# EAGLE design mrShark Debugger (EAGLE 6.1)
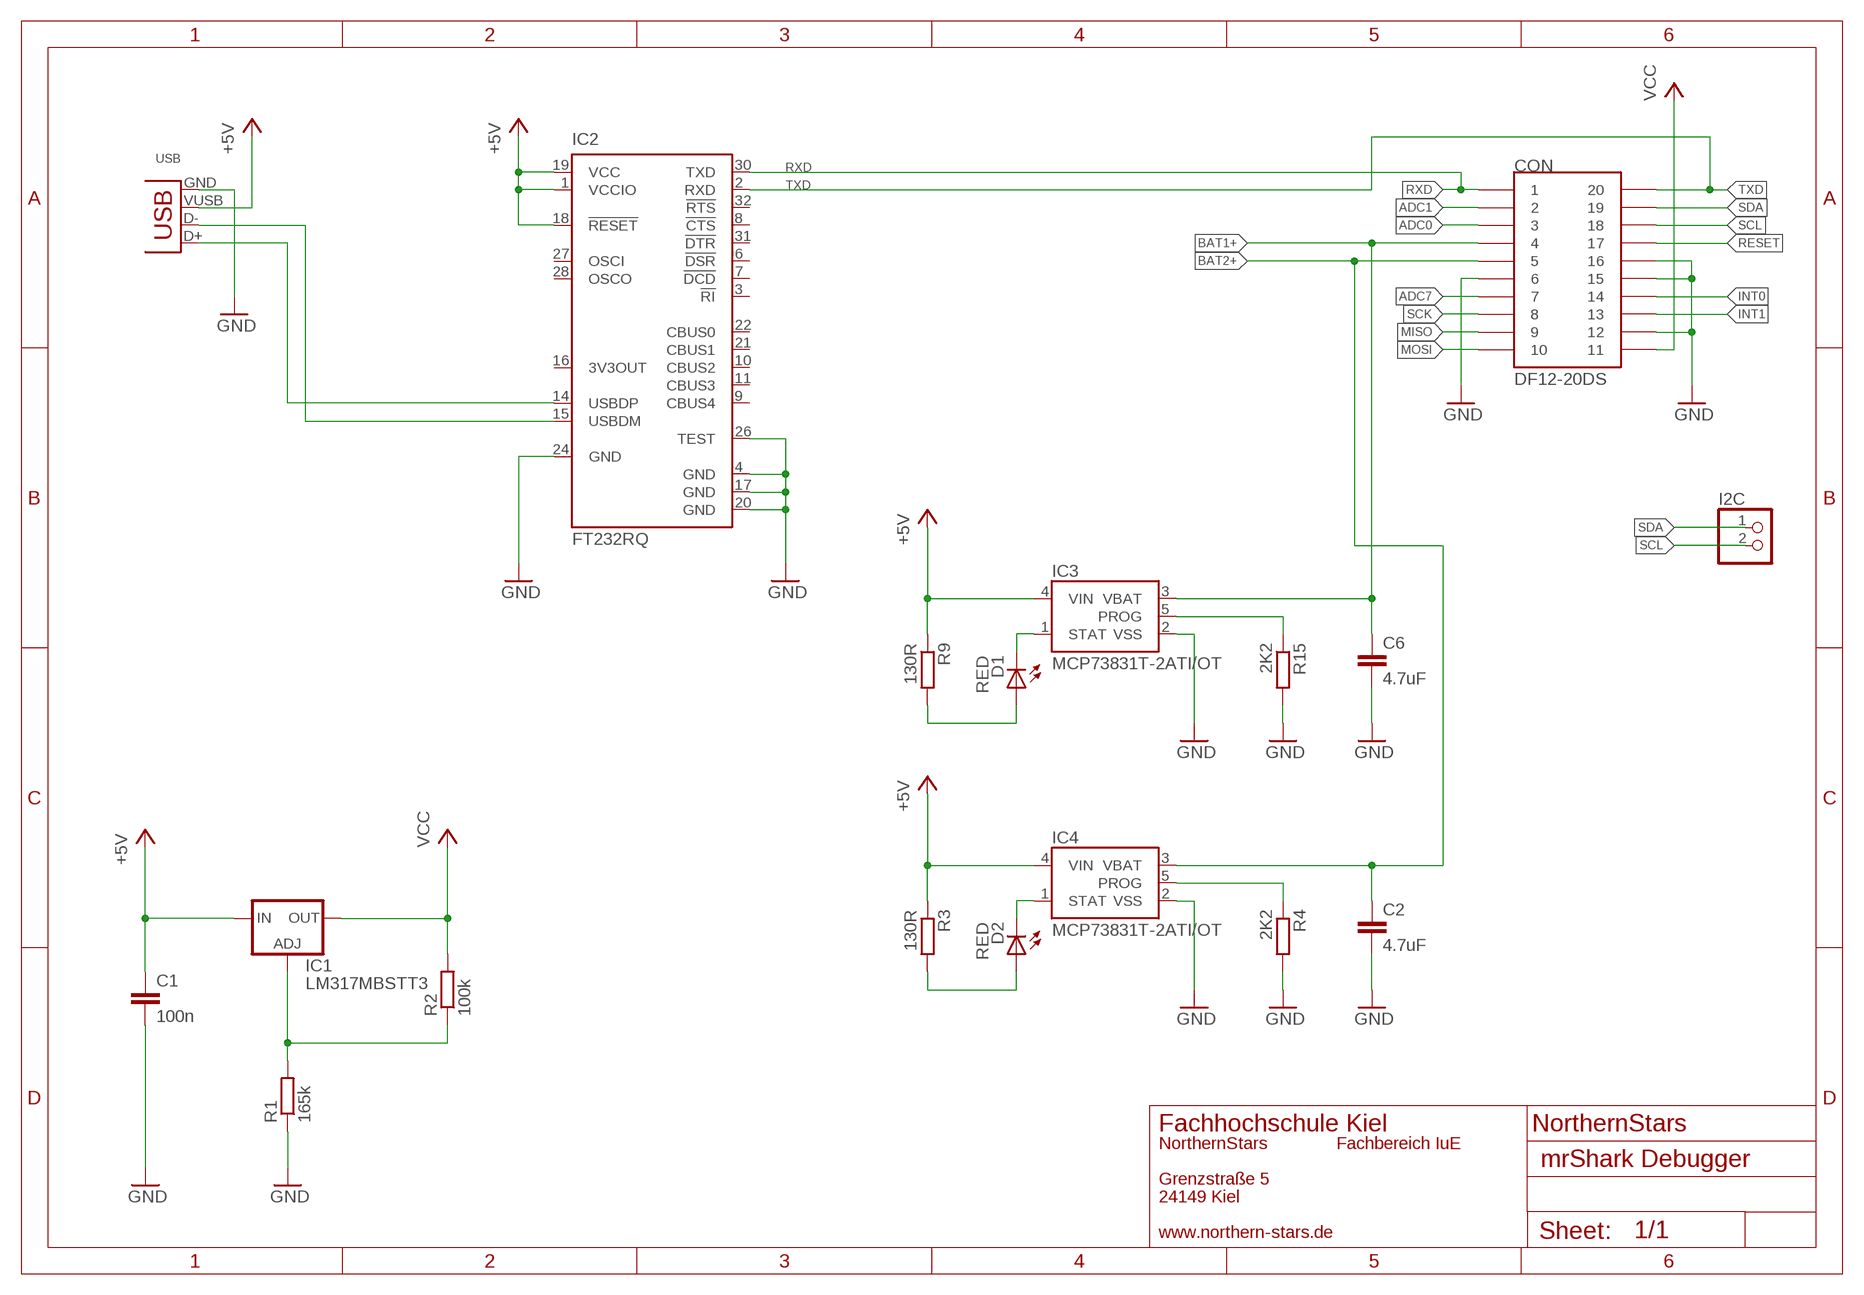
[diagram p0: schematic, sheet 1]

## Parts
C1  100n  C-EUC0201  [C0201]
C2  4.7uF  C-EUC0805  [C0805]
C6  4.7uF  C-EUC0805  [C0805]
CON  DF12-20DS  [DF12-20DS]
D1  RED  LEDCHIP-LED0603  [CHIP-LED0603]
D2  RED  LEDCHIP-LED0603  [CHIP-LED0603]
I2C  PINHD-1X02_2.54-SMD  [1X02SMD]
IC1  LM317MBSTT3  [SOT223]
IC2  FT232RQ  [QFN32]
IC3  MCP73831T-2ATI/OT  MCP73831  [SOT23-5]
IC4  MCP73831T-2ATI/OT  MCP73831  [SOT23-5]
R1  165k  R-EU_R0201  [R0201]
R2  100k  R-EU_R0201  [R0201]
R3  130R  R-EU_R0201  [R0201]
R4  2K2  R-EU_R0201  [R0201]
R9  130R  R-EU_R0201  [R0201]
R15  2K2  R-EU_R0201  [R0201]
USB  USB-B-S  [USB-B-SMT]

## Nets
+5V: C1.1 IC1.3(IN) IC2.1(VCCIO) IC2.18(!RESET) IC2.19(VCC) IC3.4(VIN) IC4.4(VIN) R3.1 R9.1 USB.VUSB(VBUS)
ADC0: CON.3
ADC1: CON.2
ADC7: CON.7
BAT1+: C6.1 CON.4 IC3.3(VBAT)
BAT2+: C2.1 CON.5 IC4.3(VBAT)
D+: IC2.14(USBDP) USB.D+
D-: IC2.15(USBDM) USB.D-
GND: C1.2 C2.2 C6.2 CON.6 CON.12 CON.15 CON.16 IC2.4(GND) IC2.17(GND) IC2.20(GND) IC2.24(GND) IC2.26(TEST) IC3.2(VSS) IC4.2(VSS) R1.1 R4.2 R15.2 USB.GND
INT0: CON.14
INT1: CON.13
MISO: CON.9
MOSI: CON.10
N$1: D1.A R9.2
N$2: D2.A R3.2
N$3: IC1.1(ADJ) R1.2 R2.1
PROG: IC3.5(PROG) R15.1
PROG1: IC4.5(PROG) R4.1
RESET: CON.17
RXD: CON.1 IC2.30(TXD)
SCK: CON.8
SCL: CON.18 I2C.2
SDA: CON.19 I2C.1
STAT: D1.C IC3.1(STAT)
STAT1: D2.C IC4.1(STAT)
TXD: CON.20 IC2.2(RXD)
VCC: CON.11 IC1.4(OUT) R2.2
Unconnected: IC2.3(!RI) IC2.6(!DSR) IC2.7(!DCD) IC2.8(!CTS) IC2.9(CBUS4) IC2.10(CBUS2) IC2.11(CBUS3) IC2.16(3V3OUT) IC2.21(CBUS1) IC2.22(CBUS0) IC2.27(OSCI) IC2.28(OSCO) IC2.31(!DTR) IC2.32(!RTS)

## Notes on the sheet
- Fachhochschule Kiel | NorthernStars
- NorthernStars | Fachbereich IuE
- Grenzstraße 5
- 24149 Kiel
- www.northern-stars.de

## Library data of the parts
C1 C2 C6 = rcl:C-EU: CAPACITOR, European symbol
CON = con-hirose:DF12-20: HRS-Hirose DF12-Series 0.5mm Pitch SMT Board to Board Connector 20 contacts
D1 D2 = led:LED: LED OSRAM: - CHIPLED LG R971, LG N971, LY N971, LG Q971, LY Q971, LO R971, LY R971 LH N974, LH R974 LS Q976, LO Q976, LY Q976 LO Q996 - Hyper CHIPLED LW Q18S LB Q993, LB Q99A, LB R99A - SideLED LS A670, LO A670, LY A670, LG A670, LP A670 LB A673, LV A673, LT A673, LW A673 LH A674 LY A675 LS A676, LA A676, LO A676, LY A676, LW A676 LS A679, LY A679, LG A679 - Hyper Micro SIDELED® LS Y876, LA Y876, LO Y876, LY Y876 LT Y87S - SmartLED LW L88C, LW L88S LB L89C, LB L89S, LG L890 LS L89K, LO L89K, LY L89K LS L896, LA L896, LO L896, LY L896 - TOPLED LS T670, LO T670, LY T670, LG T670, LP T670 LSG T670, LSP T670, LSY T670, LOP T670, LYG T670 LG T671, LOG T671, LSG T671 LB T673, LV T673, LT T673, LW T673 LH T674 LS T676, LA T676, LO T676, LY T676, LB T676, LH T676, LSB T676, LW T676 LB T67C, LV T67C, LT T67C, LS T67K, LO T67K, LY T67K, LW E67C LS E67B, LA E67B, LO E67B, LY E67B, LB E67C, LV E67C, LT E67C LW T67C LS T679, LY T679, LG T679 LS T770, LO T770, LY T770, LG T770, LP T770 LB T773, LV T773, LT T773, LW T773 LH T774 LS E675, LA E675, LY E675, LS T675 LS T776, LA T776, LO T776, LY T776, LB T776 LHGB T686 LT T68C, LB T68C - Hyper Mini TOPLED® LB M676 - Mini TOPLED Santana® LG M470 LS M47K, LO M47K, LY M47K Source: http://www.osram.convergy.de LUXEON: - LUMILED® LXK2-PW12-R00, LXK2-PW12-S00, LXK2-PW14-U00, LXK2-PW14-V00 LXK2-PM12-R00, LXK2-PM12-S00, LXK2-PM14-U00 LXK2-PE12-Q00, LXK2-PE12-R00, LXK2-PE12-S00, LXK2-PE14-T00, LXK2-PE14-U00 LXK2-PB12-K00, LXK2-PB12-L00, LXK2-PB12-M00, LXK2-PB14-N00, LXK2-PB14-P00, LXK2-PB14-Q00 LXK2-PR12-L00, LXK2-PR12-M00, LXK2-PR14-Q00, LXK2-PR14-R00 LXK2-PD12-Q00, LXK2-PD12-R00, LXK2-PD12-S00 LXK2-PH12-R00, LXK2-PH12-S00 LXK2-PL12-P00, LXK2-PL12-Q00, LXK2-PL12-R00 Source: www.luxeon.com KINGBRIGHT: KA-3528ASYC Source: www.kingbright.com
I2C = pinhead-2:PINHD-1X02: PIN HEADER
IC1 = v-reg:LM317?*: 500 mA Adjustable Output Positive Voltage Regulator Source: http://www.onsemi.co.jp .. LM317M-D.PDF
IC2 = ftdichip:FT232R: Source: http://www.ftdichip.com/Documents/DataSheets/DS_FT232R_v104.pdf
IC3 IC4 = SparkFun:MCP73831: Microchip's MCP73831 Miniature single cell, fully integrated Li-Ion, Li-polymer charge management controller http://ww1.microchip.com/downloads/en/DeviceDoc/21984a.pdf
R1-R4 R9 R15 = rcl:R-EU_: RESISTOR, European symbol
USB = con-usb-3:USB: USB Connectors

## Board
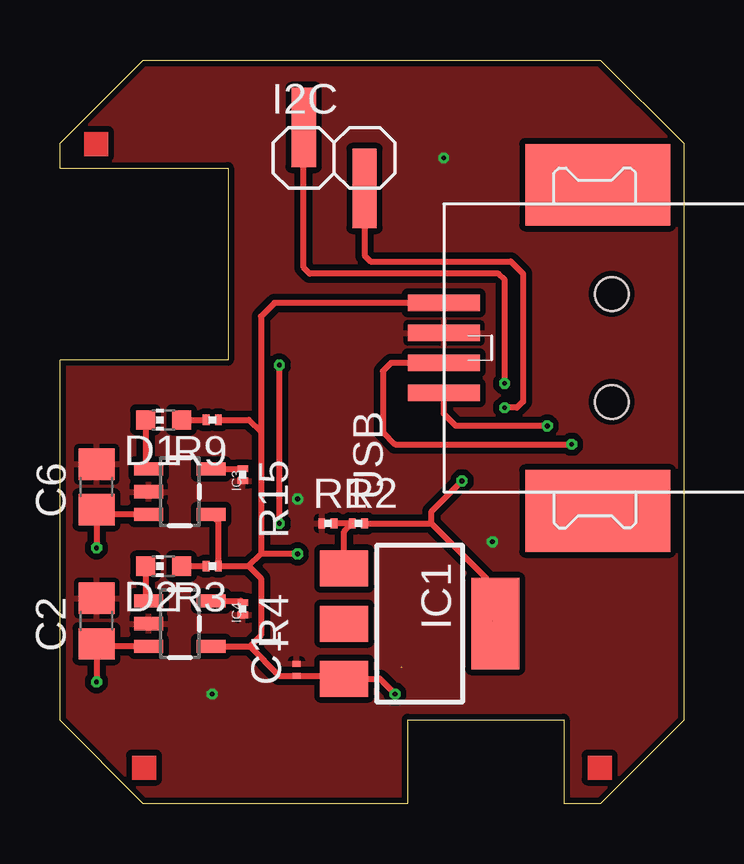
[diagram p1: board, top side]
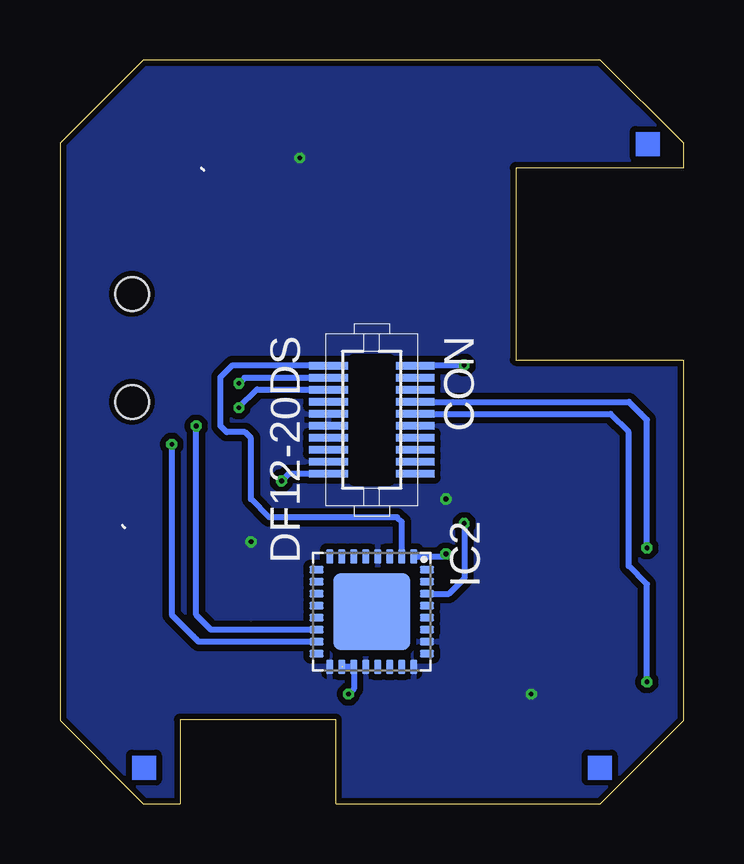
[diagram p2: board, bottom side, seen from below]

Size 26 x 31 mm. Coordinates in mm from the lower left corner, seen from the top.
Outline: 0,3.47 0,18.5 7,18.5 7,26.5 0,26.5 0,27.53 3.47,31 22.53,31 26,27.53 26,3.47 22.53,0 21,0 21,3.5 14.5,3.5 14.5,0 3.47,0 0,3.47
Copper layers (1*16): Top 0.035mm / dielectric 1.5mm / Bottom 0.035mm
Design rules "default": minimum track width 5mil, minimum drill 0.2mm, track to track 5mil, track to pad 5mil, pad to pad 5mil, via to via 5mil, smd to smd 5mil, copper to edge 5mil, drill to drill 5mil, minimum pad ring 5mil, minimum via ring 5mil, stop-mask expansion 0.075mm, vias tented up to drill 0mil, thermal gap 0.2mm

### Footprints (pad centres in the part's own frame; a part is rotated, then mirrored left to right if it is on the bottom)
C0201 = smd 0.25 x 0.35: 1 -0.25,0; 2 0.25,0
C0805 = smd 1.3 x 1.5: 1 -0.95,0; 2 0.95,0
DF12-20DS = smd 0.32 x 1.62: 1 -2.25,1.81; 2 -1.75,1.81; 3 -1.25,1.81; 4 -0.75,1.81; 5 -0.25,1.81; 6 0.25,1.81; 7 0.75,1.81; 8 1.25,1.81; 9 1.75,1.81; 10 2.25,1.81; 11 2.25,-1.81; 12 1.75,-1.81; 13 1.25,-1.81; 14 0.75,-1.81; 15 0.25,-1.81; 16 -0.25,-1.81; 17 -0.75,-1.81; 18 -1.25,-1.81; 19 -1.75,-1.81; 20 -2.25,-1.81
CHIP-LED0603 = smd 0.8 x 0.8: A 0,-0.75; C 0,0.75
1X02SMD = smd 1.016 x 3.302: 1 -1.27,1.27; 2 1.27,-1.27
SOT223 = smd 1.5 x 2: 1 -2.3,-3.15; 2 0,-3.15; 3 2.3,-3.15 | smd 3.8 x 2: 4 0,3.15
QFN32 = smd 0.6 x 0.3: 1 -2.3,1.75; 2 -2.3,1.25; 3 -2.3,0.75; 4 -2.3,0.25; 5 -2.3,-0.25; 6 -2.3,-0.75; 7 -2.3,-1.25; 8 -2.3,-1.75; 17 2.3,-1.75; 18 2.3,-1.25; 19 2.3,-0.75; 20 2.3,-0.25; 21 2.3,0.25; 22 2.3,0.75; 23 2.3,1.25; 24 2.3,1.75 | smd 0.3 x 0.6: 9 -1.75,-2.3; 10 -1.25,-2.3; 11 -0.75,-2.3; 12 -0.25,-2.3; 13 0.25,-2.3; 14 0.75,-2.3; 15 1.25,-2.3; 16 1.75,-2.3; 25 1.75,2.3; 26 1.25,2.3; 27 0.75,2.3; 28 0.25,2.3; 29 -0.25,2.3; 30 -0.75,2.3; 31 -1.25,2.3; 32 -1.75,2.3 | smd 3.2 x 3.2: EXP 0,0
SOT23-5 = smd 0.55 x 1.2: 1 -0.95,-1.3; 2 0,-1.3; 3 0.95,-1.3; 4 0.95,1.3; 5 -0.95,1.3
R0201 = smd 0.28 x 0.43: 1 -0.255,0; 2 0.255,0
USB-B-SMT = smd 6.04 x 3.4: 5 0.58,6.8; 6 0.58,-6.8 | smd 3 x 0.7: D+ 7,1.875; D- 7,0.625; GND 7,-0.625; VUSB 7,-1.875 | hole 1.4: 0,2.25; 0,-2.25

### Placement (x,y rotation side)
C1  9.87,5.58 90 top
C2  1.52,7.61 90 top
C6  1.52,13.2 90 top
CON  13,16 270 bottom
D1  4.32,15.99 90 top
D2  4.32,9.9 90 top
I2C  11.43,26.92 0 top
IC1  15,7.5 270 top
IC2  13,8 270 bottom
IC3  5,13 270 top
IC4  5,7.5 270 top
R1  11.18,11.68 0 top
R2  12.45,11.68 0 top
R3  6.35,9.9 180 top
R4  7.62,8.12 270 top
R9  6.35,15.99 180 top
R15  7.62,13.71 270 top
USB  23,19 180 top

### Tracks (layer width: path | path; a pad name or v marks a point on that pad's centre or on a via)
+5V  (via drill 0.2)  (1 unrouted)
  Top 0.254: v9.91,10.41 8.38,10.41 | IC3.4 6.61,11.74 R3.1 7.87,9.9 | IC4.4 7.92,6.55 | 7.92,6.55 9.14,5.33 C1.1 | C1.1 | C1.1 11.72,5.33 IC1.3 13.33,5.2 v13.97,4.56 | 7.87,9.9 8.38,9.39 8.38,7.01 7.92,6.55 | R9.1 7.87,15.99 8.38,15.49 | 8.38,15.49 8.38,10.41 | 7.87,9.9 8.38,10.41 | USB.VUSB 8.95,20.88 8.38,20.31 8.38,15.49
  Bottom 0.254: IC2.1 10.01,10.3 v9.91,10.41 | 14.22,5.71 14.22,5.7 IC2.19 13.75,4.78 v13.97,4.56
BAT1+  (via drill 0.2)
  Top 0.254: 2.03,12.05 IC3.3 1.64,12.05 1.52,11.93 v1.52,10.66 | 2.03,12.05 1.66,12.05 1.52,12.18 | C6.1 1.83,12.25 2.03,12.05
  Bottom 0.254: v1.52,10.66 1.52,15.99 1.78,16.25 2.28,16.75 CON.4
BAT2+  (via drill 0.2)
  Top 0.254: C2.1 1.64,6.55 IC4.3 1.73,6.55 1.52,6.34 v1.52,5.07
  Bottom 0.254: v1.52,5.07 1.52,9.14 2.29,9.9 2.29,15.49 3.05,16.25 CON.5
D+  (via drill 0.2)
  Top 0.254: v20.32,15.74 16.51,15.74 16,16.25 USB.D+
  Bottom 0.254: IC2.14 19.7,7.25 20.32,7.87 v20.32,15.74
D-  (via drill 0.2)
  Top 0.254: USB.D- 13.81,18.38 13.46,18.03 13.46,15.49 13.97,14.98 v21.34,14.98
  Bottom 0.254: v21.34,14.98 21.34,7.87 20.45,6.98 20.32,6.85 20.22,6.75 IC2.15
GND  (via drill 0.2)
  other vias: 9.91,12.69 6.35,4.56 16,26.92 18.03,10.91
  pour Bottom (isolate 0.254): 0,3.55 0,18.53 7.11,18.53 7.11,26.66 0,26.66 0,27.42 3.56,30.98 22.61,30.98 25.91,27.68 25.91,3.29 22.61,-0.01 21.08,-0.01 21.08,3.55 14.48,3.55 14.48,-0.01 3.56,-0.01
  pour Top (isolate 0.254): 0,3.55 0,18.53 7.11,18.53 7.11,26.66 0,26.66 0,27.42 3.56,30.98 22.61,30.98 25.91,27.68 25.91,3.29 22.61,-0.01 21.08,-0.01 21.08,3.55 14.48,3.55 14.48,-0.01 3.56,-0.01
N$1
  Top 0.254: D1.A R9.2
N$2
  Top 0.254: D2.A R3.2
N$3  (1 unrouted)
  Top 0.254: R2.1 R1.2 | IC1.1 11.85,11.33 R2.1
PROG
  Top 0.254: IC3.5 7.61,13.95 R15.1
PROG1
  Top 0.254: IC4.5 7.54,8.45 R4.1
RXD  (via drill 0.2)
  Top 0.254: v9.14,18.28 v9.14,11.68
  Bottom 0.254: IC2.30 9.78,8.75 9.14,9.39 v9.14,11.68 | CON.1 11.16,18.28 v9.14,18.28
SCL  (via drill 0.2)
  Top 0.254: I2C.2 12.7,22.85 12.95,22.6 18.8,22.6 19.3,22.09 19.3,16.76 19.05,16.5 v18.54,16.5
  Bottom 0.254: v18.54,16.5 17.78,17.26 14.82,17.26 CON.18
SDA  (via drill 0.2)
  Top 0.254: v18.54,17.52 18.54,21.84 18.29,22.09 10.41,22.09 10.16,22.34 I2C.1
  Bottom 0.254: CON.19 18.31,17.75 v18.54,17.52
STAT
  Top 0.254: D1.C 3.57,14.08 IC3.1
STAT1
  Top 0.254: D2.C 3.57,8.58 IC4.1
TXD
  Bottom 0.254: IC2.2 11.75,11.74 11.94,11.93 17.27,11.93 18.03,12.69 18.03,15.23 18.29,15.49 19.05,15.49 19.3,15.74 19.3,17.77 18.8,18.28 14.84,18.28 CON.20
VCC  (via drill 0.2)  (1 unrouted)
  Top 0.254: 18.03,7.62 IC1.4 | R2.2 15.49,11.68 | 15.49,11.68 17.78,9.39 17.78,7.87 18.03,7.61 | 15.49,11.68 15.49,12.18 v16.76,13.45
  Bottom 0.254: CON.11 16.47,13.75 v16.76,13.45
(copper drawn outside any net)
  shapes: Bottom area x3, Top area x3

### Text on the board
tTest: SDA | SCL | I²C | BAT1 | BAt2 | NorthernStars | mrShark Debugger
tDocu: 1 | 2